# EasyEDA Pro project PS2toUSB.eprj

# Schematic Schematic1
Create Date: 2024-06-01; Page Name: P1; Project Name: PS2toUSB; Schematic Name: Schematic1; Update Date: 2024-06-03; Company: 嘉立创EDA; Page Size: A4; Version: V1.0
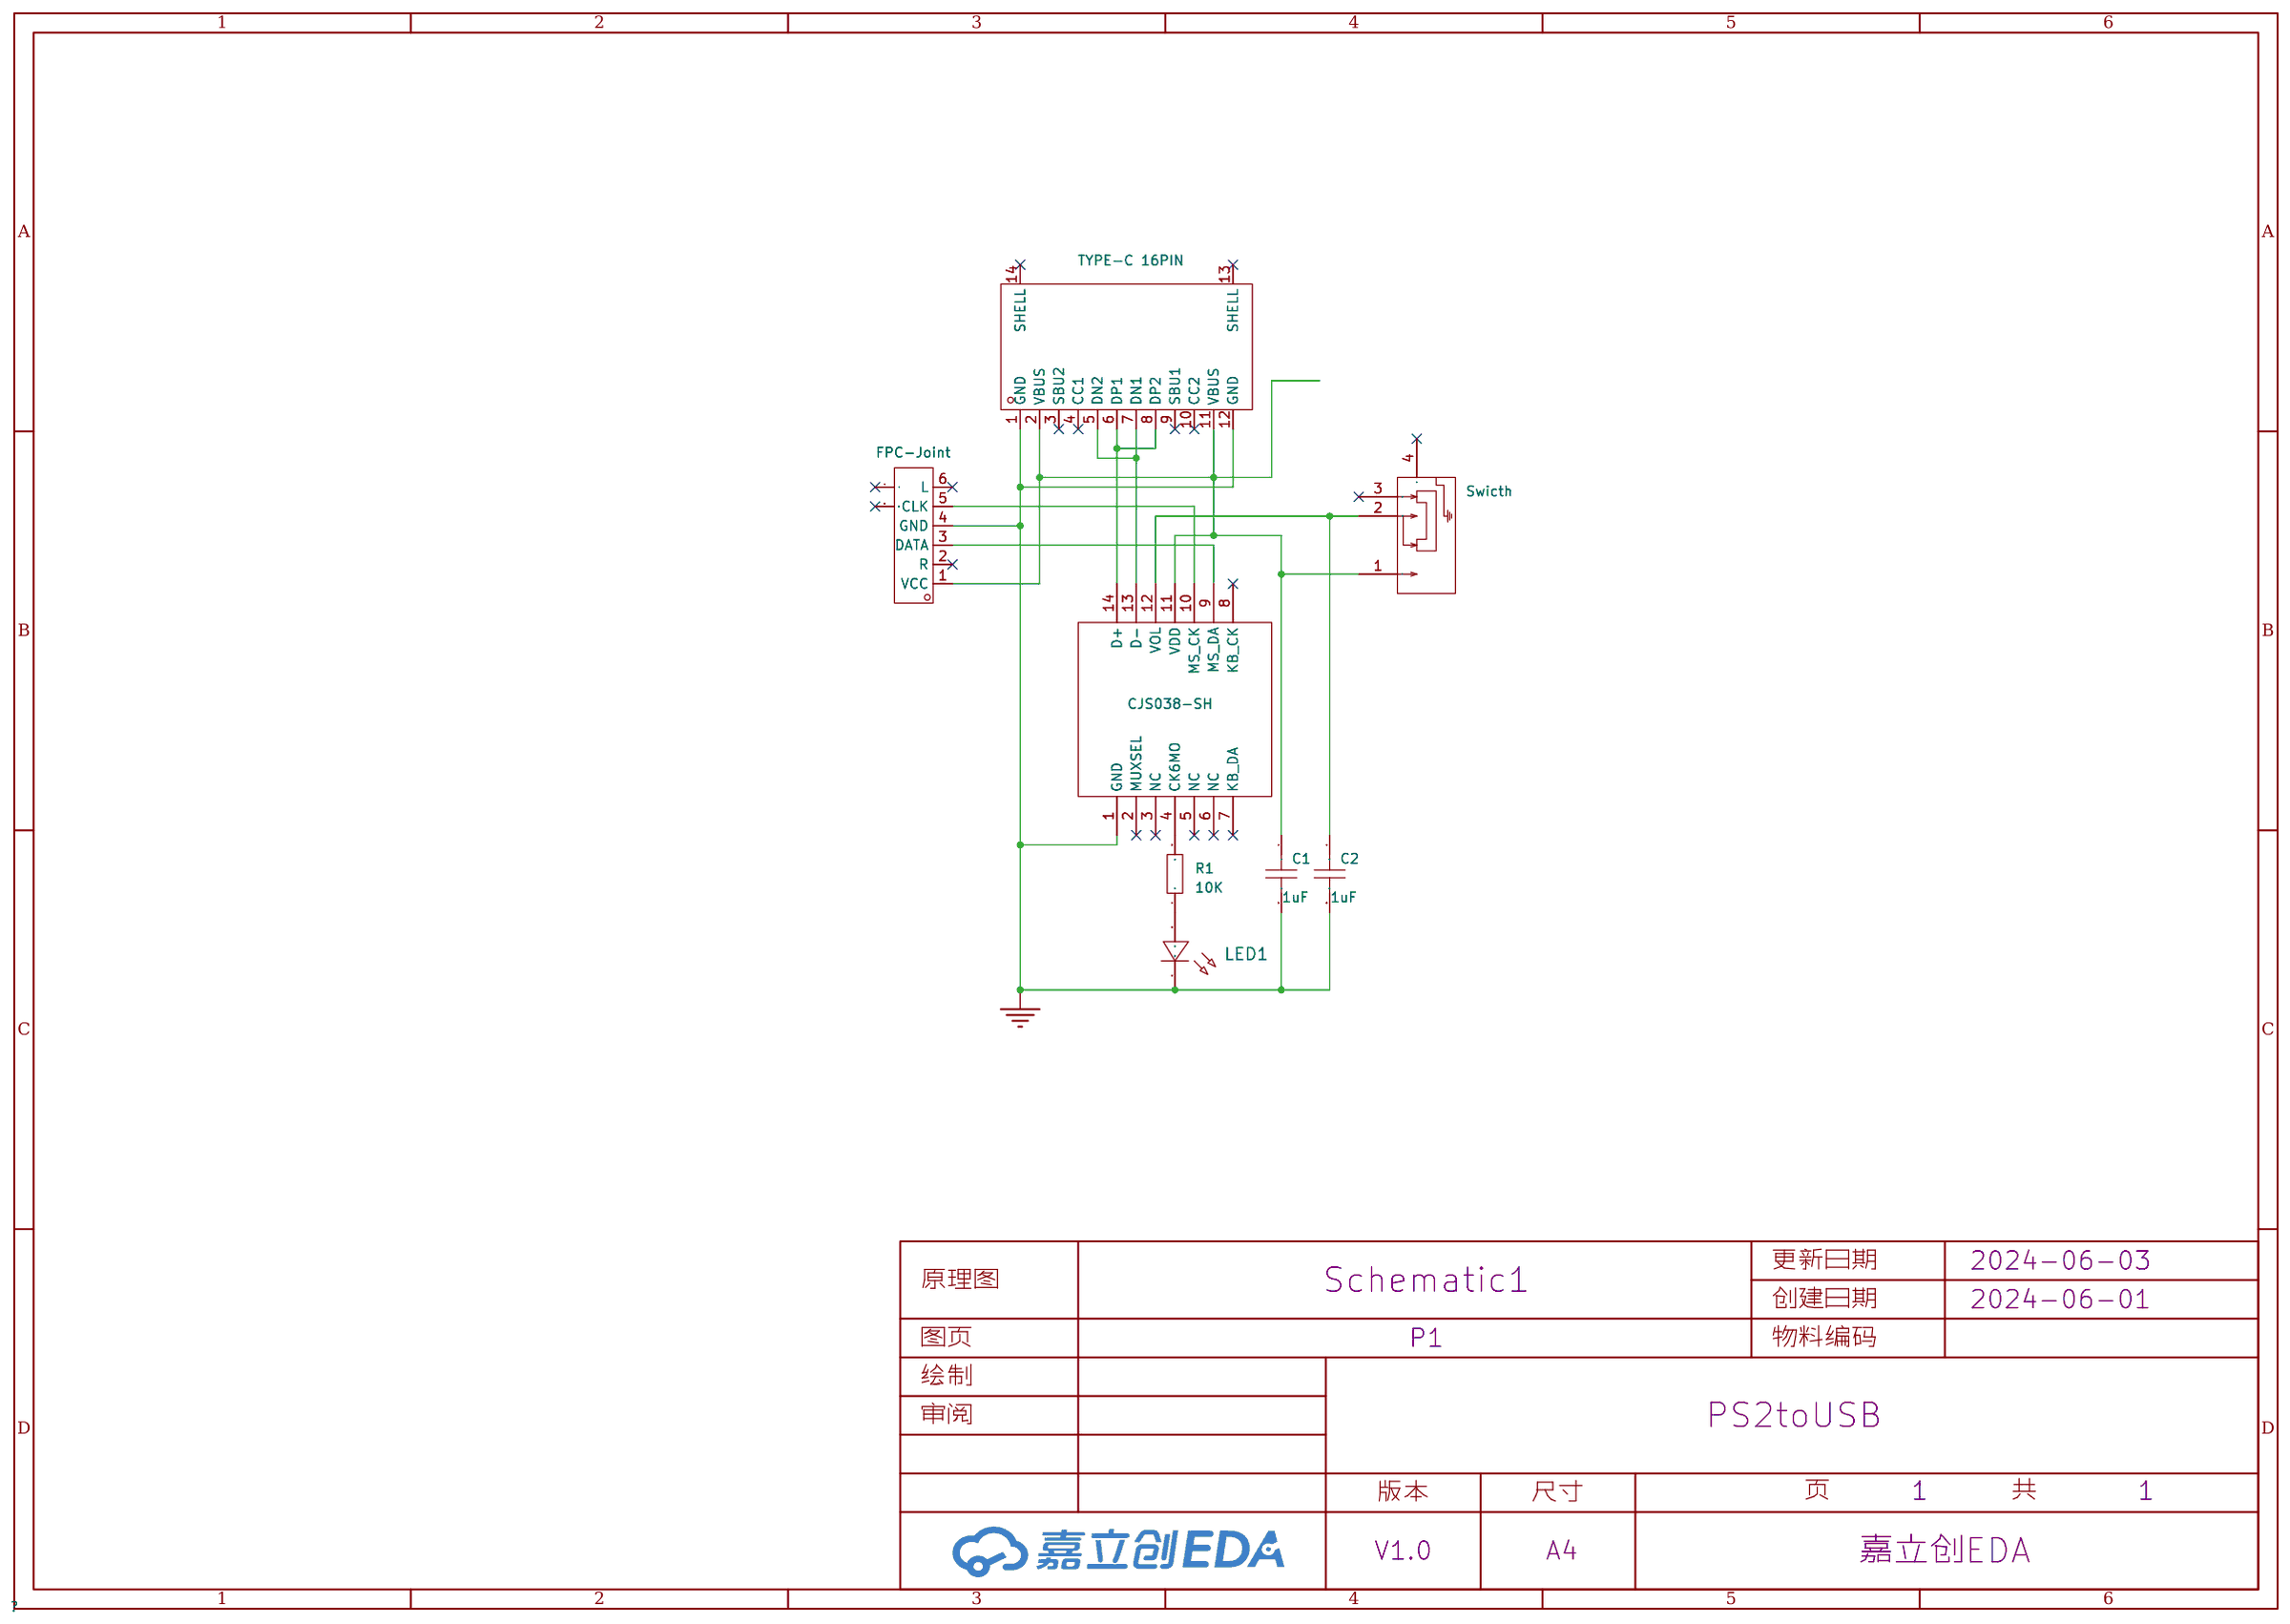
[diagram p0: schematic sheet]

## Parts
C1  1uF  [C0603]
C2  1uF  [C0603]
CJS038-SH  -  [CJS038-SH]
FPC-Joint  VCC  [FPC-SMD_C47271]
LED1  -  [LED_0603]
R1  10K  [R0603]
SW1  Swicth  [SW-TH_MSK12C02]
USB1  TYPE-C 16PIN  [USB-C-SMD_TYPE-C-6PIN-2MD-073]

## Library data of the parts
C1 C2 = CAP_0603: Supplier Footprint: 0603
CJS038-SH = CJS038-SH: 协议转换芯片，将PS/2信号转换成USB信号
FPC-Joint = 1.0-6P上接: 锁定特性:抽屉式;触点类型:上接;触点数量:6P;间距:1mm;安装类型:卧贴;工作温度范围:-25℃~+85℃;; LCSC Part Name: 间距:1mm P数:6P 抽屉式 上接; Supplier Part: C47271; Manufacturer: BOOMELE(博穆精密); Supplier Footprint: SMD,P=1mm,卧贴; Datasheet: https://atta.szlcsc.com/upload/public/pdf/source/20231027/443F616BA0A67C4DA05E58DE2BCDE40A.pdf; Supplier: LCSC; Locking Feature: 抽屉式; Contact Type: 上接; Number of Contacts: 6P; Pitch: 1mm; Mounting Type: 卧贴; FFC, FCB Thickness: 0.3mm; Height Above Board: 2.8mm; Operating Temperature Range: -25℃~+85℃
LED1 = LED_0603-R: Supplier Footprint: 0603
R1 = Res_0603: Supplier Footprint: 0603
SW1 = MSK12C02: 电路结构:单刀双掷;安装方式:卧贴;开关颜色:-;额定电流(DC):50mA;额定电压(DC):12V;额定电流(AC):-;额定电压(AC):-;机械寿命:1万次;; LCSC Part Name: 两档侧拨贴片 7脚 滑动开关; Supplier Part: C431540; Manufacturer: SHOU HAN(首韩); Supplier Footprint: SMD; Datasheet: https://atta.szlcsc.com/upload/public/pdf/source/20190925/C431540_89155AEF0758B9AD1B2D805F83FB12E3.pdf; Supplier: LCSC; Circuit: 单刀双掷; Pin Style: SMD接片; Switch Length: 8mm; Switch Width: 2.8mm; Switch Height: 1.4mm; Mounting Style: 卧贴; Current Rating (DC): 50mA; Voltage Rating (DC): 12V; Mechanical Life: 1万次; Operating Temperature: -20℃~+70℃
USB1 = TYPE-C 16PIN 2MD(073): 连接器类型:Type-C;标准:-;公母:母;端口数量:1;触点数量:16P;安装方式:卧贴;额定电流 - 电源:5A;工作温度范围:-25℃~+85℃;; LCSC Part Name: Type-C 母 卧贴; Supplier Part: C2765186; Manufacturer: SHOU HAN(首韩); Supplier Footprint: SMD; Datasheet: https://atta.szlcsc.com/upload/public/pdf/source/20211123/39B17C16241EAC15C5E277BDA434118E.pdf; Supplier: LCSC; Connector Type: Type-C; Gender: 母; Number of Ports: 1; Number of Contacts: 16P; Mounting Style: 卧贴; Current Rating - Power (Max): 5A; Operating Temperature Range: -25℃~+85℃

## Nets
GND: C1.2 C2.2 CJS038-SH.1(GND) FPC-Joint.4(GND) LED1.1(C) USB1.1(GND) USB1.12(GND)
$1N1095: CJS038-SH.10(MS_CK) FPC-Joint.5(CLK)
$1N1099: CJS038-SH.9(MS_DA) FPC-Joint.3(DATA)
$1N1166: CJS038-SH.4(CK6MO) R1.2
$1N1217: LED1.2(A) R1.1
$1N1486: C2.1 CJS038-SH.12(VOL) SW1.2
Net-(C1-1): C1.1 CJS038-SH.11(VDD) FPC-Joint.1(VCC) SW1.1 USB1.2(VBUS) USB1.11(VBUS)
Net-(CJS038-SH-13): CJS038-SH.13(D-) USB1.5(DN2) USB1.7(DN1)
Net-(CJS038-SH-14): CJS038-SH.14(D+) USB1.6(DP1) USB1.8(DP2)

Not connected (* = marked no-connect by the designer): CJS038-SH 2(MUXSEL)* 3(NC)* 5(NC)* 6(NC)* 7(KB_DA)* 8(KB_CK)*; FPC-Joint 2(R)* 6(L)* 7* 8*; SW1 3* 4*; USB1 3(SBU2)* 4(CC1)* 9(SBU1)* 10(CC2)* 13(SHELL)* 14(SHELL)*

# Board PCB1
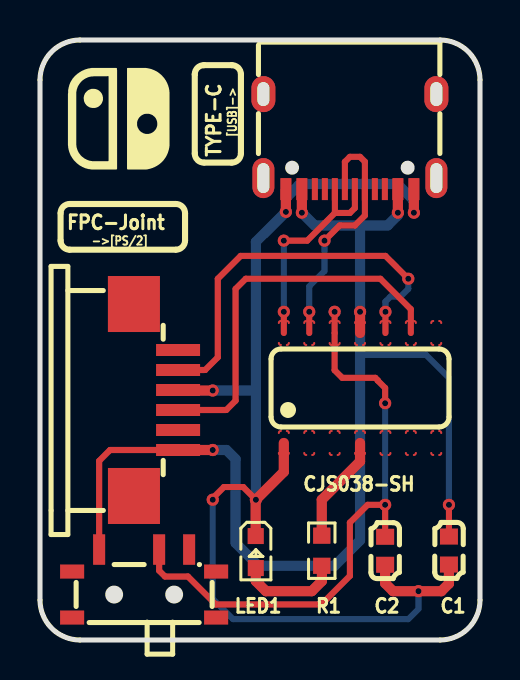
[diagram p1: board, top side]
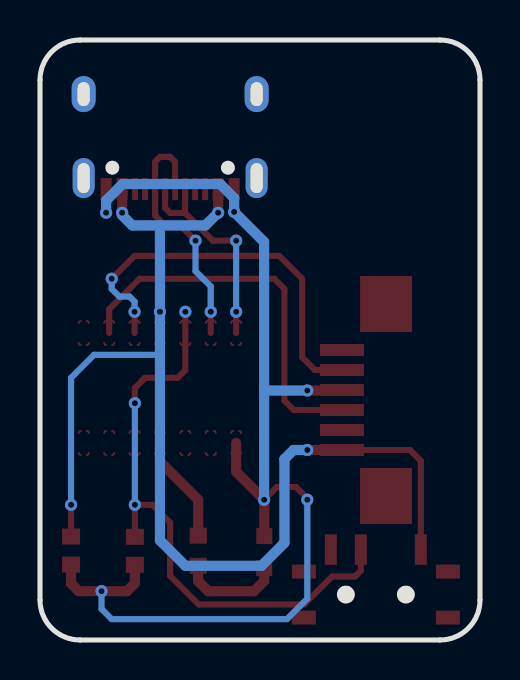
[diagram p2: board, bottom side, seen from below]

Outline 22 x 30 mm; copper layers: Top Layer, Bottom Layer. Coordinates in mm from the lower left corner of the outline.
Outline path: 0,28 0,2 arc(0.59,0.59) 2,0 20,0 arc(21.41,0.59) 22,2 22,28 arc(21.41,29.41) 20,30 2,30 arc(0.59,29.41) 0,28
Stack: Top Layer 0.035mm / Dielectric1 1.51mm FR4 er 4.5 / Bottom Layer 0.035mm

## Design rules (mm)
template: JLCPCB Capability(Two Layers Board)
spacing copperThickness1oz (default): track to track 0.102, other pairs 0.152 to 0.3
spacing copperThickness2oz: track to track 0.203, other pairs 0.152 to 0.3
track width copperThickness1oz (default): min 0.127, default 0.254, max 2.54
track width copperThickness2oz: min 0.203, default 0.254, max 2.54
differential pair differentialPair (default): width min 0.127, default 0.254, max 2.54; gap min 0.152, default 0.152
via viaSize (default): diameter min 0.5, default 0.61, max 10; hole min 0.3, default 0.305, max 6.3

## Placement (name value [footprint] x y rotation side)
C1  1uF  [C0603]  20.45 4.47 270 top
C2  1uF  [C0603]  17.26 4.46 270 top
CJS038-SH  -  [CJS038-SH]  16 12.6 90 top
FPC-Joint  VCC  [FPC-SMD_C47271]  5.8 12 270 top
LED1  -  [LED_0603]  10.79 4.35 270 top
R1  10K  [R0603]  14.09 4.46 90 top
SW1  Swicth  [SW-TH_MSK12C02]  5.21 2.82 0 top
TYPE-C  TYPE-C 16PIN  [USB-C-SMD_TYPE-C-6PIN-2MD-073]  15.49 24.92 180 top

## Footprints (pads in the part's own frame, mm; a bottom-side part is the same pattern mirrored in y, then rotated)
C0603
  rect 0.8x0.9 smd: 1(-0.7,0) 2(0.7,0)
CJS038-SH
  custom 1.2x0.5 smd: 1(-2.75,3.81) 2(-2.75,2.54) 3(-2.75,1.27) 4(-2.75,0) 5(-2.75,-1.27) 6(-2.75,-2.54) 7(-2.75,-3.81) 8(2.75,-3.81) 9(2.75,-2.54) 10(2.75,-1.27) 11(2.75,0) 12(2.75,1.27) 13(2.75,2.54) 14(2.75,3.81)
FPC-SMD_C47271
  rect 0.6x2.2 smd: 1(2.5,1.103) 2(1.5,1.103) 3(0.5,1.103) 4(-0.5,1.103) 5(-1.5,1.103) 6(-2.5,1.103)
  rect 2.8x2.6 smd: 7(-4.8,-1.103) 8(4.8,-1.101)
LED_0603
  rect 0.8x0.8 smd: 1(-0.851,-0.01) 2(0.75,-0.005)
R0603
  rect 0.806x0.864 smd: 1(-0.753,0) 2(0.753,0)
SW-TH_MSK12C02
  rect 0.6x1.524 smd: 1(-2.25,1.7) 2(0.75,1.7) 3(2.25,1.7)
  rect 1.2x0.7 smd: 4(-3.6,0.6) 4(-3.6,-1.7) 4(3.6,0.6) 4(3.6,-1.7)
USB-C-SMD_TYPE-C-6PIN-2MD-073
  rect 0.55x1.1 smd: 1(-3.2,2.375) 2(-2.4,2.375) 11(2.4,2.375) 12(3.2,2.375)
  rect 0.3x1.1 smd: 3(-1.75,2.375) 4(-1.25,2.375) 5(-0.75,2.375) 6(-0.25,2.375) 7(0.25,2.375) 8(0.75,2.375) 9(1.25,2.375) 10(1.75,2.375)
  oval 1.1x2 hole 0.6x1.5: 13(-4.325,1.825) 14(4.325,1.825)
  oval 1.2x1.8 hole 0.6x1.2: 13(-4.325,-2.375) 14(4.325,-2.375)

## Nets
GND: C1.2 C2.2 CJS038-SH.1 FPC-Joint.4 LED1.1 TYPE-C.1 TYPE-C.12
$1N1058: CJS038-SH.14 TYPE-C.6 TYPE-C.8
$1N1070: CJS038-SH.13 TYPE-C.5 TYPE-C.7
$1N1095: CJS038-SH.10 FPC-Joint.5
$1N1099: CJS038-SH.9 FPC-Joint.3
$1N1166: CJS038-SH.4 R1.2
$1N1217: LED1.2 R1.1
$1N1486: C2.1 CJS038-SH.12 SW1.2
$1N1494: C1.1 CJS038-SH.11 FPC-Joint.1 SW1.1 TYPE-C.2 TYPE-C.11

Pads without a net: CJS038-SH 2 3 5 6 7 8; FPC-Joint 2 6 7 8; SW1 3 4; TYPE-C 3 4 9 10 13 14

## Via types
v1: diameter 0.61, hole 0.305, Top Layer to Bottom Layer, 20 vias

## Routing (per net, layer and track width the routed paths; a pad name or vN(x,y) marks a point on that pad's centre or on a via; arc(x,y) is an arc through that point)
GND: length 59.8
  Top Layer w0.305: v1(8.64,7.01) 8.64,7.09 9.19,7.65 10.16,7.65 v1(10.79,7.01)
  Top Layer w0.508: CJS038-SH.1 12.19,8.41 v1(10.79,7.01) 10.78,7 LED1.1 ; FPC-Joint.4 6.93,12.47 v1(8.64,12.47) ; C2.2 17.26,2.84 17.65,2.44 v1(18.92,2.44) 20.07,2.44 20.45,2.82 20.45,3.65 20.32,3.77 ; TYPE-C.1 v1(18.69,21.36) ; TYPE-C.12 v1(12.29,21.41)
  Bottom Layer w0.305: v1(8.64,7.01) 8.64,2.06 9.65,1.04 18.41,1.04 18.92,1.55 v1(18.92,2.44)
  Bottom Layer w0.508: v1(8.64,12.47) 10.72,12.47 10.79,12.55 ; 10.79,12.55 v1(10.79,7.01) ; 10.79,12.55 10.79,19.91 v1(12.29,21.41) 12.29,22.1 12.99,22.8 17.87,22.8 18.69,21.97 v1(18.69,21.36)
$1N1058: length 11
  Top Layer w0.305: TYPE-C.8 14.74,21.35 ; 14.74,21.35 15.49,21.35 15.74,21.6 TYPE-C.6 ; 14.74,21.35 13.36,19.97 v1(12.19,19.97) ; CJS038-SH.14 v1(12.19,16.41)
  Bottom Layer w0.305: v1(12.19,16.41) v1(12.19,19.97)
$1N1070: length 12.7
  Top Layer w0.305: TYPE-C.7 15.24,23.91 15.49,24.16 16,24.16 16.24,23.92 TYPE-C.5 16.24,21.22 15.75,20.73 14.99,20.73 v1(14.22,19.97) ; CJS038-SH.13 v1(13.46,16.41)
  Bottom Layer w0.305: v1(14.22,19.97) 14.22,18.44 13.46,17.68 v1(13.46,16.41)
$1N1095: length 20.1
  Top Layer w0.305: FPC-Joint.5 8.26,13.5 8.89,14.13 8.89,18.06 10.03,19.2 17.27,19.2 v1(18.41,18.06) ; v1(17.27,16.41) CJS038-SH.10
  Bottom Layer w0.305: v1(18.41,18.06) 18.41,17.55 18.03,17.17 17.53,17.17 17.27,16.92 v1(17.27,16.41)
$1N1099: length 19.4
  Top Layer w0.305: CJS038-SH.9 18.54,16.54 17.02,18.06 10.29,18.06 9.78,17.55 9.78,11.97 9.31,11.5 FPC-Joint.3
$1N1166: length 5.4
  Top Layer w0.508: R1.2 14.09,7.01 16,8.93 CJS038-SH.4
$1N1217: length 5.1
  Top Layer w0.508: R1.1 14.1,3.7 14.1,2.95 13.59,2.44 11.3,2.44 10.79,2.95 LED1.2
$1N1486: length 29.7
  Top Layer w0.305: v1(17.26,11.84) 17.26,12.6 16.89,12.97 16.89,12.98 16.76,13.11 15.11,13.11 14.73,13.49 CJS038-SH.12 v1(14.73,16.41) ; C2.1 v1(17.26,6.76) 16.38,6.76 15.49,5.87 15.49,3.2 14.07,1.78 8.79,1.78 7.4,3.17 6.25,3.17 5.96,3.47 5.96,4.27
  Bottom Layer w0.305: v1(17.26,6.76) v1(17.26,11.84)
$1N1494: length 60.7
  Top Layer w0.305: 20.32,5.17 20.45,5.3 v1(20.45,6.76) ; 2.96,4.27 2.96,8.95 3.5,9.5 FPC-Joint.1
  Top Layer w0.508: FPC-Joint.1 8.51,9.5 ; TYPE-C.2 v1(17.89,21.36) ; v1(16,16.41) CJS038-SH.11 ; TYPE-C.11 v1(13.09,21.36)
  Bottom Layer w0.305: 16,14.26 19.3,14.26 20.45,13.11 v1(20.45,6.76)
  Bottom Layer w0.508: v1(17.89,21.36) 17.89,21.24 17.39,20.73 16,20.73 ; 16,20.73 13.73,20.73 v1(13.09,21.36) ; 16,20.73 v1(16,16.41) 16,4.98 14.73,3.71 10.92,3.71 9.78,4.85 9.78,9.05 9.32,9.5 v1(8.64,9.5)

## Copper pours and planes (outline as drawn; the poured copper is in the pictures)
GND on Top Layer: 0,30 22.1,30 22.1,-0.1 0,-0.1
GND on Bottom Layer: -0.76,30.64 22.73,30.64 22.73,-0.86 -0.76,-0.86

## Text on the board
Top Silkscreen Layer: ->[PS/2] | [USB]->
